# EAGLE design at88g.v1 (EAGLE 4.16)
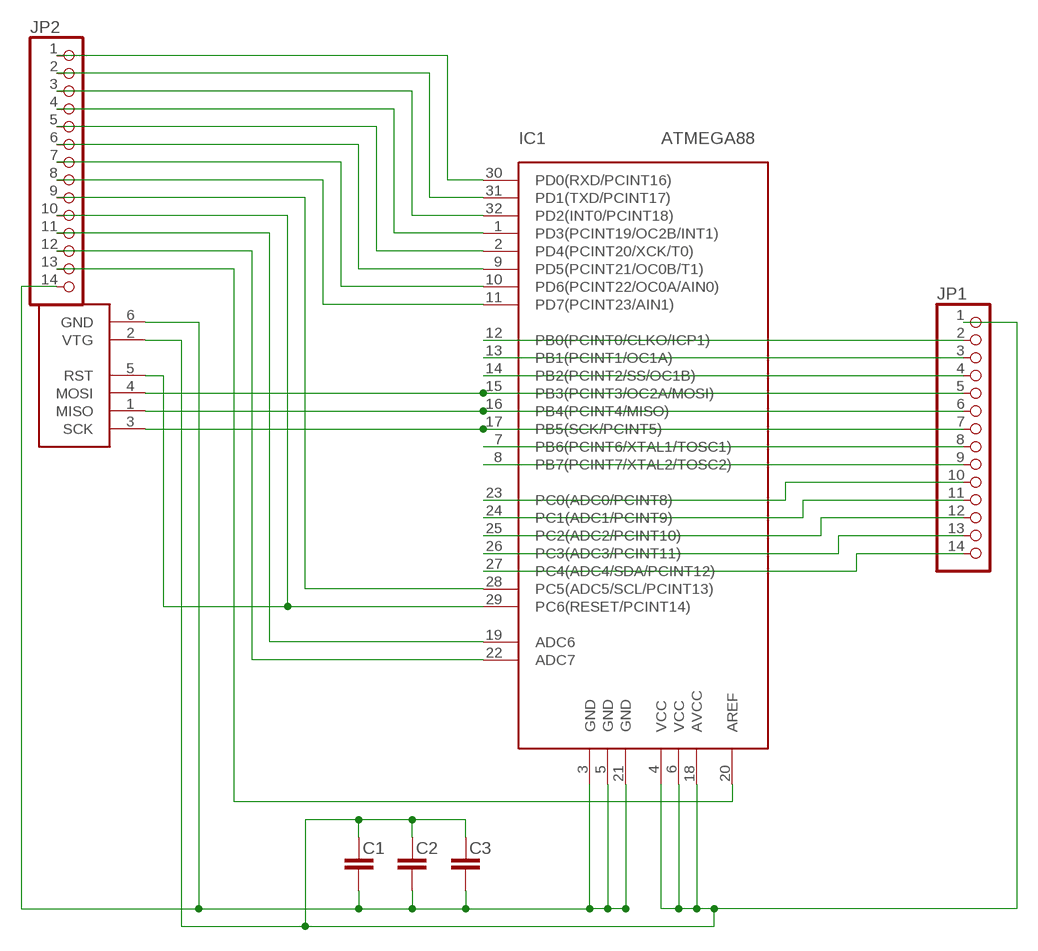
[diagram p0: schematic, sheet 1]

## Parts
C1  C-EU  [C0603]
C2  C-EU  [C0603]
C3  C-EU  [C0603]
IC1  ATMEGA88  [TQFP32]
JP1  PINHD-1X14  [1X14]
JP2  PINHD-1X14  [1X14]
X1  AVRISP6PIN  [6PIN]

## Nets
GND: C1.2 C2.2 C3.2 IC1.3(GND) IC1.5(GND) IC1.21(GND) JP2.14 X1.6(GND)
N$1: IC1.29(PC6(RESET/PCINT14)) JP2.10 X1.5(RST)
N$2: IC1.15(PB3(PCINT3/OC2A/MOSI)) JP1.5 X1.4(MOSI)
N$3: IC1.16(PB4(PCINT4/MISO)) JP1.6 X1.1(MISO)
N$4: IC1.17(PB5(SCK/PCINT5)) JP1.7 X1.3(SCK)
N$5: IC1.30(PD0(RXD/PCINT16)) JP2.1
N$6: IC1.31(PD1(TXD/PCINT17)) JP2.2
N$7: IC1.32(PD2(INT0/PCINT18)) JP2.3
N$8: IC1.1(PD3(PCINT19/OC2B/INT1)) JP2.4
N$9: IC1.2(PD4(PCINT20/XCK/T0)) JP2.5
N$10: IC1.9(PD5(PCINT21/OC0B/T1)) JP2.6
N$11: IC1.10(PD6(PCINT22/OC0A/AIN0)) JP2.7
N$12: IC1.11(PD7(PCINT23/AIN1)) JP2.8
N$13: IC1.12(PB0(PCINT0/CLKO/ICP1)) JP1.2
N$14: IC1.13(PB1(PCINT1/OC1A)) JP1.3
N$15: IC1.14(PB2(PCINT2/SS/OC1B)) JP1.4
N$16: IC1.7(PB6(PCINT6/XTAL1/TOSC1)) JP1.8
N$17: IC1.8(PB7(PCINT7/XTAL2/TOSC2)) JP1.9
N$18: IC1.23(PC0(ADC0/PCINT8)) JP1.10
N$19: IC1.24(PC1(ADC1/PCINT9)) JP1.11
N$20: IC1.25(PC2(ADC2/PCINT10)) JP1.12
N$21: IC1.26(PC3(ADC3/PCINT11)) JP1.13
N$22: IC1.27(PC4(ADC4/SDA/PCINT12)) JP1.14
N$23: IC1.28(PC5(ADC5/SCL/PCINT13)) JP2.9
N$24: IC1.19(ADC6) JP2.11
N$25: IC1.22(ADC7) JP2.12
N$26: IC1.20(AREF) JP2.13
VCC: C1.1 C2.1 C3.1 IC1.4(VCC) IC1.6(VCC) IC1.18(AVCC) JP1.1 X1.2(VTG)

## Library data of the parts
C1-C3 = rcl:C-EU
IC1 = atmega88:ATMEGA88
JP1 JP2 = pinhead-mm:PINHD-1X14
X1 = avrisp:AVRISP6PIN

## Board
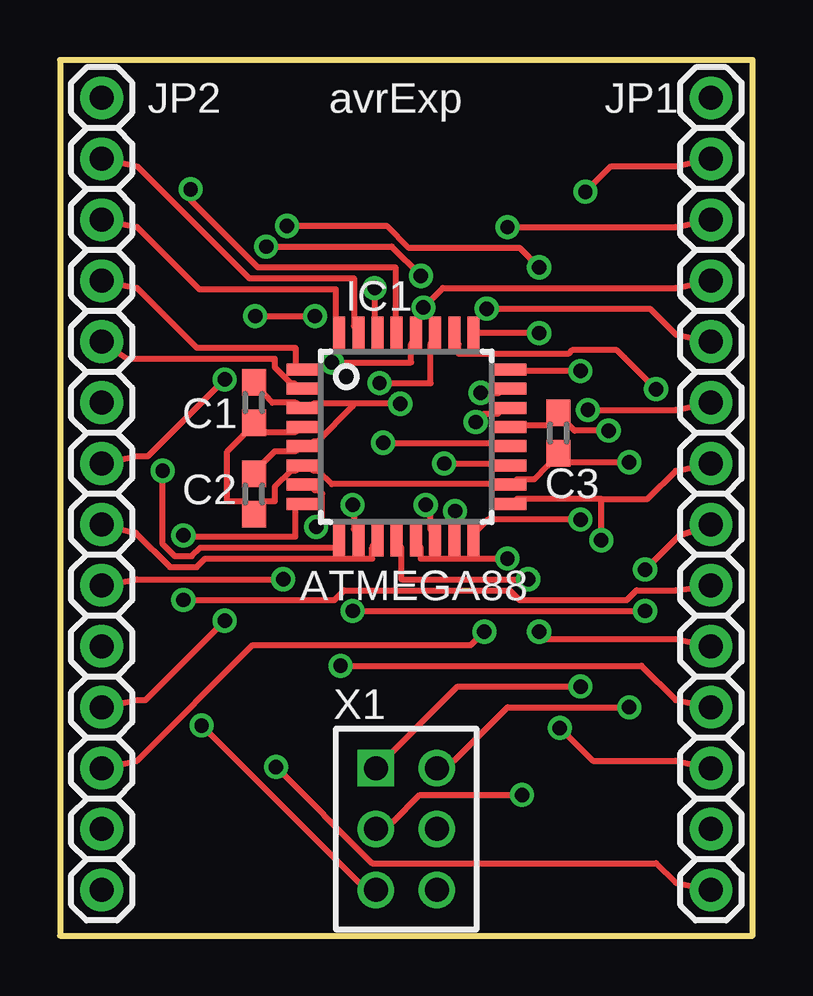
[diagram p1: board, top side]
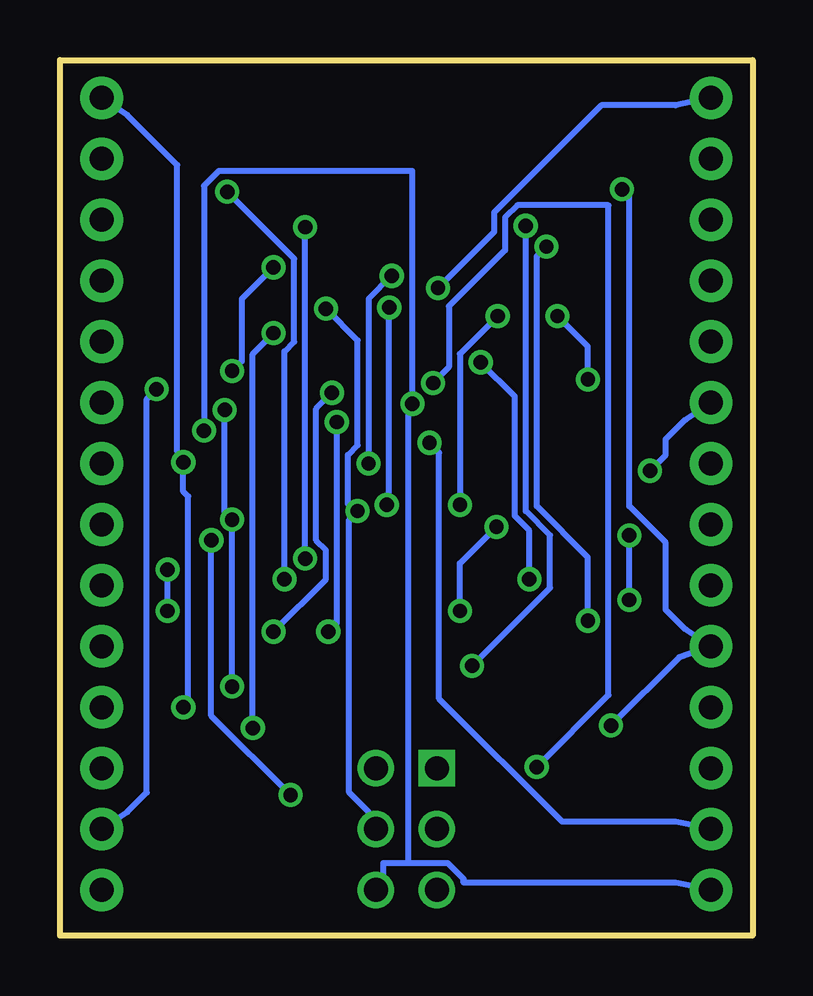
[diagram p2: board, bottom side, seen from below]

Size 28.88 x 36.5 mm. Coordinates in mm from the lower left corner, seen from the top.
Outline: 0,0 28.88,0 28.88,36.5 0,36.5 0,0
Copper layers (1*16): Top 0.035mm / dielectric 1.5mm / Bottom 0.035mm
Design rules "default": minimum track width 10mil, minimum drill 0.6mm, track to track 8mil, track to pad 8mil, pad to pad 8mil, via to via 8mil, smd to smd 8mil, copper to edge 40mil, drill to drill 8mil, minimum pad ring 10mil, minimum via ring 8mil, stop-mask expansion 4mil, vias tented up to drill 0mil, thermal gap 10mil

### Footprints (pad centres in the part's own frame; a part is rotated, then mirrored left to right if it is on the bottom)
C0603 = smd 1.1 x 1: 1 -0.85,0; 2 0.85,0
TQFP32 = smd 1.5 x 0.5: 1 -4.25,2.65; 2 -4.25,1.85; 3 -4.25,1.05; 4 -4.25,0.25; 5 -4.25,-0.55; 6 -4.25,-1.35; 7 -4.25,-2.15; 8 -4.25,-2.95; 17 4.25,-2.95; 18 4.25,-2.15; 19 4.25,-1.35; 20 4.25,-0.55; 21 4.25,0.25; 22 4.25,1.05; 23 4.25,1.85; 24 4.25,2.65 | smd 0.5 x 1.5: 9 -2.8,-4.4; 10 -2,-4.4; 11 -1.2,-4.4; 12 -0.4,-4.4; 13 0.4,-4.4; 14 1.2,-4.4; 15 2,-4.4; 16 2.8,-4.4; 25 2.8,4.1; 26 2,4.1; 27 1.2,4.1; 28 0.4,4.1; 29 -0.4,4.1; 30 -1.2,4.1; 31 -2,4.1; 32 -2.8,4.1
1X14 = drill 1 pad 1.778 round: 1 -16.51,0; 2 -13.97,0; 3 -11.43,0; 4 -8.89,0; 5 -6.35,0; 6 -3.81,0; 7 -1.27,0; 8 1.27,0; 9 3.81,0; 10 6.35,0; 11 8.89,0; 12 11.43,0; 13 13.97,0; 14 16.51,0
6PIN = drill 1 square: 1 -1.27,2.54 | drill 1 round: 2 1.27,2.54; 3 -1.27,0; 4 1.27,0; 5 -1.27,-2.54; 6 1.27,-2.54

### Placement (x,y rotation side)
C1  8.09,22.22 90 top
C2  8.09,18.41 90 top
C3  20.79,20.95 90 top
IC1  14.44,20.95 0 top
JP1  27.14,18.41 270 top
JP2  1.74,18.41 270 top
X1  14.44,4.44 0 top

### Tracks (layer width: path | path; a pad name or v marks a point on that pad's centre or on a via)
GND  (via drill 0.6)
  Top 0.254: C2.2 8.55,19.78 8.95,20.19 9.82,20.19 IC1.5 10.58,20.59 10.73,20.59 12.21,22.07 12.21,22.17 | IC1.21 19.06,21.26 20.33,21.26 C3.2 21.25,21.26 21.45,21.05 v22.87,21.05 | C1.2 8.55,22.53 8.85,22.22 9.82,22.22 IC1.3 10.58,22.17 12.21,22.17 | v14.19,22.17 12.21,22.17
  Bottom 0.254: 14.34,3.02 15.41,3.02 15.41,2.61 X1.6 | 14.34,3.02 12.71,3.02 12.05,2.36 12.05,2.21 3.21,2.21 JP2.14 | v22.87,21.05 22.87,31.26 22.26,31.87 14.19,31.87 v14.19,22.17 14.34,21.71 14.34,3.02
N$1  (via drill 0.6)
  Top 0.254: v5.45,31.11 5.45,30.65 8.24,27.86 13.98,27.86 13.98,25.42 IC1.29 | v5.91,8.76 12.46,2.21 X1.5
  Bottom 0.254: v5.45,31.11 5.14,30.81 5.14,17.9 3.62,16.38 3.62,13.58 2.81,12.77 JP2.10 3.06,11.6 v5.91,8.76
N$2  (via drill 0.6)
  Top 0.254: v16.47,17.7 16.47,16.94 IC1.15 | v17.79,26.13 24.6,26.13 25.67,25.06 JP1.5
  Bottom 0.254: X1.4 16.02,5.15 16.83,5.96 16.83,17.34 v16.47,17.7 16.88,18 16.88,20.04 16.47,20.44 16.47,24.81 v17.79,26.13
N$3  (via drill 0.6)
  Top 0.254: v21.7,17.34 17.84,17.34 17.44,16.94 IC1.16 | v22.01,21.92 25.67,21.92 JP1.6 | v21.7,10.38 16.57,10.38 X1.1
  Bottom 0.254: v22.01,21.92 22.01,17.65 v21.7,17.34 v21.7,10.38
N$4  (via drill 0.6)
  Top 0.254: 22.57,18.21 24.5,18.21 25.67,19.38 JP1.7 | 22.57,18.21 19.06,18.21 IC1.17 | v19.27,5.86 15,5.86 13.88,4.75 X1.3 | v22.57,16.48 22.57,18.21
  Bottom 0.254: v19.27,5.86 22.57,9.16 v22.57,16.48
N$5  (via drill 0.6)
  Top 0.254: v13.12,27 13.12,25.42 IC1.30
  Bottom 0.254: v13.12,27 10.78,29.33 10.78,30.14 6.31,34.62 3.21,34.62 JP2.1
N$6
  Top 0.254: IC1.31 12.26,25.42 12.26,27.4 7.89,27.4 3.21,32.08 JP2.2
N$7
  Top 0.254: IC1.32 11.49,25.42 11.49,26.94 5.8,26.94 3.21,29.53 JP2.3
N$8
  Top 0.254: IC1.1 9.82,23.8 9.82,24.51 5.7,24.51 3.21,27 JP2.4
N$9
  Top 0.254: IC1.2 9.82,22.98 9.77,23.03 9.61,23.03 8.95,23.69 8.95,24.05 2.81,24.05 JP2.5
N$10  (via drill 0.6)
  Top 0.254: v4.28,19.38 4.28,16.33 4.79,15.82 5.5,15.82 5.86,16.18 11.44,16.18 IC1.9
  Bottom 0.254: v4.28,19.38 3.62,20.04 3.62,20.7 2.81,21.51 JP2.6
N$11  (via drill 0.6)
  Top 0.254: v12.21,17.95 12.26,17.95 12.26,16.94 IC1.10 | v8.14,25.83 v10.63,25.83 | v6.87,23.19 3.67,19.98 3.21,19.98 JP2.7
  Bottom 0.254: v12.21,17.95 12.21,24.25 v10.63,25.83 | v8.14,25.83 6.87,24.56 v6.87,23.19
N$12
  Top 0.254: IC1.11 13.02,16.18 13.02,15.72 6.06,15.72 5.7,15.36 4.59,15.36 3.16,16.78 JP2.8
N$13  (via drill 0.6)
  Top 0.254: v19.52,14.85 14.24,14.85 14.24,16.18 IC1.12 | v21.91,31.01 22.97,32.08 25.67,32.08 JP1.2
  Bottom 0.254: v19.52,14.85 19.52,24.35 19.11,24.76 19.11,28.21 v21.91,31.01
N$14  (via drill 0.6)
  Top 0.254: v18.66,15.72 15.05,15.72 15.05,16.18 IC1.13 | v18.66,29.53 25.67,29.53 JP1.3
  Bottom 0.254: v18.66,15.72 v18.66,29.53
N$15  (via drill 0.6)
  Top 0.254: v15.25,17.95 15.46,17.95 15.46,16.94 IC1.14 | v15.15,26.18 15.96,27 25.67,27 JP1.4
  Bottom 0.254: v15.25,17.95 15.15,18.05 v15.15,26.18
N$16  (via drill 0.6)
  Top 0.254: v10.68,17.04 10.94,17.04 10.94,18.41 10.78,18.56 10.63,18.56 10.58,18.61 IC1.7 | v12.21,13.53 v24.4,13.53 | v24.4,15.26 25.82,16.68 JP1.8
  Bottom 0.254: v10.68,17.04 12.21,15.51 v12.21,13.53 | v24.4,13.53 v24.4,15.26
N$17  (via drill 0.6)
  Top 0.254: v5.14,16.68 5.19,16.63 9.82,16.63 9.82,17.8 IC1.8 | v5.14,13.99 11.44,13.99 11.85,14.4 18.76,14.4 19.16,13.99 23.63,13.99 24.04,14.4 25.67,14.4 JP1.9
  Bottom 0.254: v5.14,13.99 v5.14,16.68
N$18  (via drill 0.6)
  Top 0.254: v17.54,22.63 18.3,22.63 IC1.23 | v19.98,12.67 20.28,12.37 25.67,12.37 JP1.10
  Bottom 0.254: v17.54,22.63 18.2,21.97 18.2,16.48 17.79,16.07 17.79,14.85 v19.98,12.67
N$19  (via drill 0.6)
  Top 0.254: v21.7,23.54 19.06,23.54 IC1.24 | v19.98,27.86 19.16,28.67 14.54,28.67 13.63,29.59 v9.46,29.59 | v11.7,11.25 24.24,11.25 25.67,9.83 JP1.11
  Bottom 0.254: v21.7,23.54 21.3,23.95 21.3,26.54 v19.98,27.86 | v9.46,29.59 9.46,17.7 8.45,16.68 8.45,14.5 v11.7,11.25
N$20  (via drill 0.6)
  Top 0.254: v19.98,25.12 17.44,25.12 IC1.25 | v20.84,8.66 22.21,7.29 25.67,7.29 JP1.12
  Bottom 0.254: v19.98,25.12 20.84,24.25 v20.84,8.66
N$21  (via drill 0.6)
  Top 0.254: v24.85,22.78 23.23,24.4 21.35,24.4 21.2,24.25 16.62,24.25 16.62,24.66 IC1.26
  Bottom 0.254: v24.85,22.78 25.26,22.37 25.26,5.96 26.07,5.15 JP1.13
N$22  (via drill 0.6)
  Top 0.254: v13.32,23.03 15.46,23.03 15.46,24.66 IC1.27 | v9,7.03 13.02,3.02 24.85,3.02 25.67,2.21 JP1.14
  Bottom 0.254: v13.32,23.03 12.66,23.69 12.66,26.23 10.32,28.57 10.32,29.94 9.82,30.45 6.01,30.45 6.01,10.03 v9,7.03
N$23  (via drill 0.6)
  Top 0.254: v11.34,23.9 14.64,23.9 14.64,24.66 IC1.28 | v9.31,14.85 3.21,14.85 JP2.9
  Bottom 0.254: v11.34,23.9 9.92,22.47 9.92,17.5 9.31,16.89 v9.31,14.85
N$24  (via drill 0.6)
  Top 0.254: v16.02,19.68 18.3,19.68 IC1.19 | v15.05,27.5 13.83,28.72 v8.6,28.72 | v6.87,13.13 3.57,9.83 3.21,9.83 JP2.11
  Bottom 0.254: v16.02,19.68 16.02,26.54 v15.05,27.5 | v8.6,28.72 9,28.32 9,17.9 6.87,15.77 v6.87,13.13
N$25  (via drill 0.6)
  Top 0.254: v17.34,21.41 17.69,21.76 18.25,21.76 18.3,21.81 IC1.22 | v17.69,12.67 17.13,12.11 8.04,12.11 3.21,7.29 JP2.12
  Bottom 0.254: v17.34,21.41 17.34,13.03 v17.69,12.67
N$26  (via drill 0.6)
  Top 0.254: v13.47,20.54 18.3,20.54 IC1.20
  Bottom 0.254: v13.47,20.54 13.07,20.14 13.07,9.88 7.94,4.75 3.21,4.75 JP2.13
VCC  (via drill 0.6)
  Top 0.254: IC1.4 9.82,21 8.55,21 C1.1 7.63,20.85 6.97,20.19 6.97,18.11 7.63,18.11 C2.1 8.55,18.11 8.95,18.11 8.95,18.72 9.61,19.38 9.82,19.38 IC1.6 10.58,19.38 10.78,19.38 11.34,18.82 18.3,18.82 IC1.18 19.06,19.02 19.77,19.02 20.33,19.58 C3.1 21.25,19.73 v23.74,19.73 | v23.74,9.52 18.66,9.52 16.42,7.29 X1.2
  Bottom 0.254: v23.74,9.52 23.53,9.72 23.53,18.31 23.74,18.51 v23.74,19.73 23.99,20.19 23.99,32.13 26.07,34.21 JP1.1

### Text on the board
tNames: avrExp